# EAGLE schematic 180V PWM motor (EAGLE 8.5.1)

## Sheet 1 of 2: 555 PWM GEN
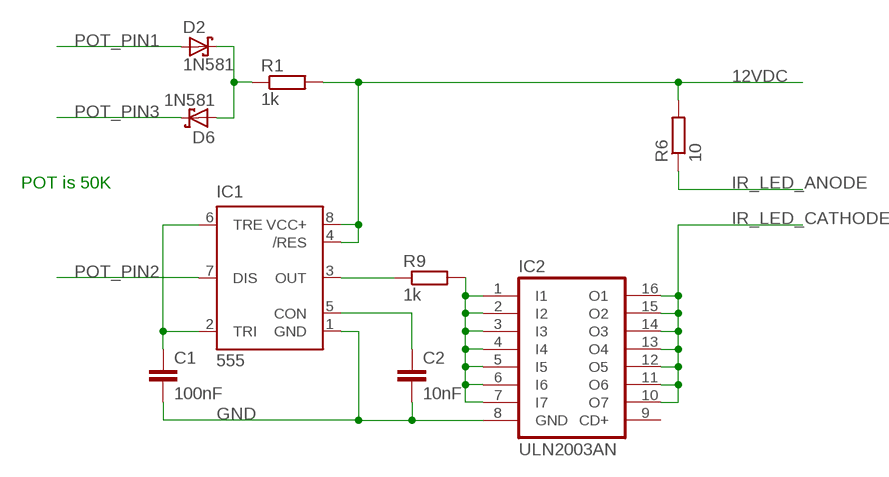
[diagram p0: schematic, sheet 1]

### Parts
C1  100nF  C-EU050-025X075  [C050-025X075]
C2  10nF  C-EU050-025X075  [C050-025X075]
D2  1N581  1N5819-B  [DO41-7.6]
D6  1N581  1N5819-B  [DO41-7.6]
IC1  555  555P  [DIP08]
IC2  ULN2003AN  [DIL16]
R1  1k  R-EU_0207/10  [0207/10]
R6  10  R-EU_0207/10  [0207/10]
R9  1k  R-EU_0207/10  [0207/10]

### Nets
12VDC: IC1.4(/RES) IC1.8(VCC+) R1.2 R6.2 ; also sheet 2
GND: C1.2 C2.2 IC1.1(GND) IC2.8(GND) ; also sheet 2
IR_LED_ANODE: R6.1
IR_LED_CATHODE: IC2.10(O7) IC2.11(O6) IC2.12(O5) IC2.13(O4) IC2.14(O3) IC2.15(O2) IC2.16(O1)
N$3: IC1.3(OUT) R9.1
N$5: C2.1 IC1.5(CON)
N$6: C1.1 IC1.2(TRI) IC1.6(TRE)
N$7: IC2.1(I1) IC2.2(I2) IC2.3(I3) IC2.4(I4) IC2.5(I5) IC2.6(I6) IC2.7(I7) R9.2
N$9: D2.C D6.A R1.1
POT_PIN1: D2.A
POT_PIN2: IC1.7(DIS)
POT_PIN3: D6.C
Unconnected: IC2.9(CD+)

### Notes on the sheet
- POT is 50K

## Sheet 2 of 2: POWER REG
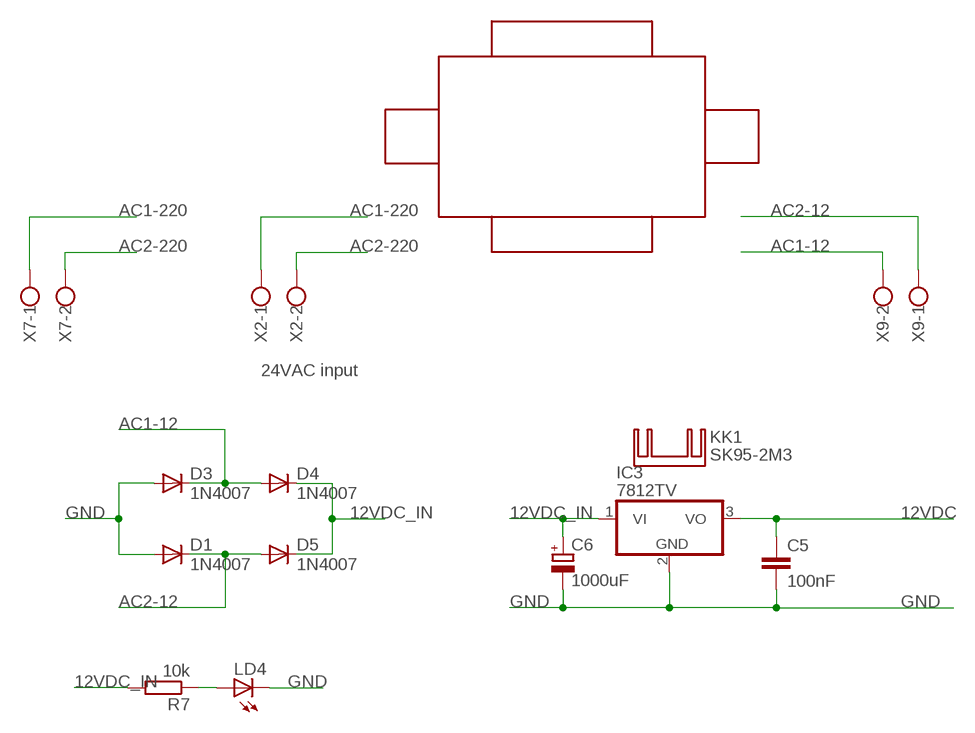
[diagram p1: schematic, sheet 2]

### Parts
C5  100nF  C-EU050-025X075  [C050-025X075]
C6  1000uF  CPOL-EUE3.5-10  [E3,5-10]
D1  1N4007  1N4004  [DO41-10]
D3  1N4007  1N4004  [DO41-10]
D4  1N4007  1N4004  [DO41-10]
D5  1N4007  1N4004  [DO41-10]
IC3  7812TV  [TO220V]
KK1  SK95-2M3  [SK95-2M3]
LD4  LED5MM  [LED5MM]
R7  10k  R-EU_0207/10  [0207/10]
U$1  TRANS_12V  [12V]
X2  W237-102  [W237-102]
X7  W237-102  [W237-102]
X9  W237-102  [W237-102]

### Nets
12VDC: C5.1 IC3.3(VO) ; also sheet 1
12VDC_IN: C6.+ D4.C D5.C IC3.1(VI) R7.2
AC1-12: D3.C D4.A X9.2
AC1-220: X2.1 X7.1
AC2-12: D1.C D5.A X9.1
AC2-220: X2.2 X7.2
GND: C5.2 C6.- D1.A D3.A IC3.2(GND) LD4.K(C) ; also sheet 1
N$8: LD4.A R7.1

### Notes on the sheet
- 24VAC input

## Library data of the parts
C1 C2 C5 = rcl:C-EU: CAPACITOR, European symbol; SPICEPREFIX: C
C6 = rcl:CPOL-EU: POLARIZED CAPACITOR, European symbol; SPICEPREFIX: C
D1 D3-D5 = adafruit:1N4004: DIODE General purpose 1N400x type rectifier (With bigger pads) http://www.ladyada.net/library/pcb/eaglelibrary.html
D2 D6 = diode:1N581*: 1.0A SCHOTTKY BARRIER RECTIFIER Source: http://www.diodes.com/datasheets/ds23001.pdf
IC1 = SparkFun-IC-Special-Function:555: General purpose bipolar Timer Datasheet <http://www.sparkfun.com/datasheets/Components/General/ne555.pdf> SparkFun Products SparkFun SparkPunk Sequencer Kit <https://www.sparkfun.com/products/12707> (KIT-12707) Storefront Component: 555 Timer <https://www.sparkfun.com/products/9273> (COM-09273) Two parts valid for production: VFP: IC-11930 (M7555 PTH) VFP: IC-09173 (555 PTH) - Preferred; PROD_ID: IC-09173; PROD_ID_ALT: IC-09173
IC2 = uln-udn:ULN2003A: DRIVER ARRAY
IC3 = linear:78*: Positive VOLTAGE REGULATOR Source: http://cache.national.com/ds/LM/LM78L05.pdf http://www.fairchildsemi.com/ds/LM/LM7805.pdf
KK1 = heatsink:SK95-2M3: HEATSINK manufacturer Fischer/distributor Buerklin
LD4 = led:LED: LED OSRAM: - CHIPLED LG R971, LG N971, LY N971, LG Q971, LY Q971, LO R971, LY R971 LH N974, LH R974 LS Q976, LO Q976, LY Q976 LO Q996 - Hyper CHIPLED LW Q18S LB Q993, LB Q99A, LB R99A - SideLED LS A670, LO A670, LY A670, LG A670, LP A670 LB A673, LV A673, LT A673, LW A673 LH A674 LY A675 LS A676, LA A676, LO A676, LY A676, LW A676 LS A679, LY A679, LG A679 - Hyper Micro SIDELED® LS Y876, LA Y876, LO Y876, LY Y876 LT Y87S - SmartLED LW L88C, LW L88S LB L89C, LB L89S, LG L890 LS L89K, LO L89K, LY L89K LS L896, LA L896, LO L896, LY L896 - TOPLED LS T670, LO T670, LY T670, LG T670, LP T670 LSG T670, LSP T670, LSY T670, LOP T670, LYG T670 LG T671, LOG T671, LSG T671 LB T673, LV T673, LT T673, LW T673 LH T674 LS T676, LA T676, LO T676, LY T676, LB T676, LH T676, LSB T676, LW T676 LB T67C, LV T67C, LT T67C, LS T67K, LO T67K, LY T67K, LW E67C LS E67B, LA E67B, LO E67B, LY E67B, LB E67C, LV E67C, LT E67C LW T67C LS T679, LY T679, LG T679 LS T770, LO T770, LY T770, LG T770, LP T770 LB T773, LV T773, LT T773, LW T773 LH T774 LS E675, LA E675, LY E675, LS T675 LS T776, LA T776, LO T776, LY T776, LB T776 LHGB T686 LT T68C, LB T68C - Hyper Mini TOPLED® LB M676 - Mini TOPLED Santana® LG M470 LS M47K, LO M47K, LY M47K Source: http://www.osram.convergy.de/
R1 R6 R9 = rcl:R-EU_: RESISTOR, European symbol
R7 = rcl-2:R-EU_: RESISTOR, European symbol
U$1 = transformer12v:TRANS_12V
X2 X7 X9 = con-wago-500:W237-102: WAGO SCREW CLAMP